# Altium schematic sheet LORASX1278.SchDoc
size A; SheetNumber: 3; SheetTotal: 3
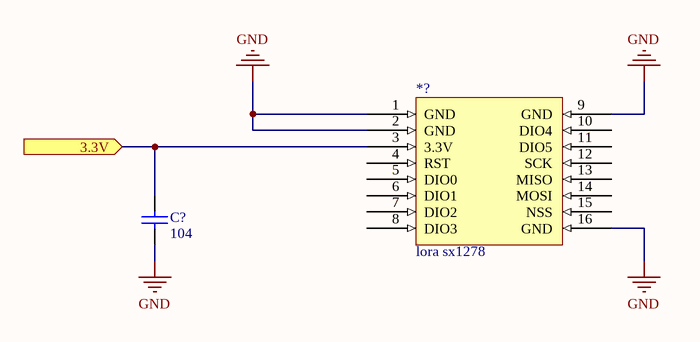
[diagram p0: LORASX1278.SchDoc]

## Parts
*?  lora sx1278  [PCBComponent_1]
C?  104  [tu 0805]

## Ports
3.3V (in)

## Nets
GND: *?.1(GND) *?.2(GND) *?.9(GND) *?.16(GND) C?.1
3.3V: *?.3(3.3V) C?.2 ; port 3.3V

Not connected (* = marked no-connect by the designer): *? 4(RST) 5(DIO0) 6(DIO1) 7(DIO2) 8(DIO3) 10(DIO4) 11(DIO5) 12(SCK) 13(MISO) 14(MOSI) 15(NSS)

## Library data of the parts
*? = Component_2
C? = Tu 0805 104 50V 10%: Dán; Don_Vi: Con; So_Chan: 2; Ten_Linh_Kien: Tụ 0805 104-100nF 10% 50V; Ma_Hang: MH004551; Chung_Loai: Dán; Kieu_Chan: *